# EAGLE schematic h_bridge_v2.1 (EAGLE 5.11)
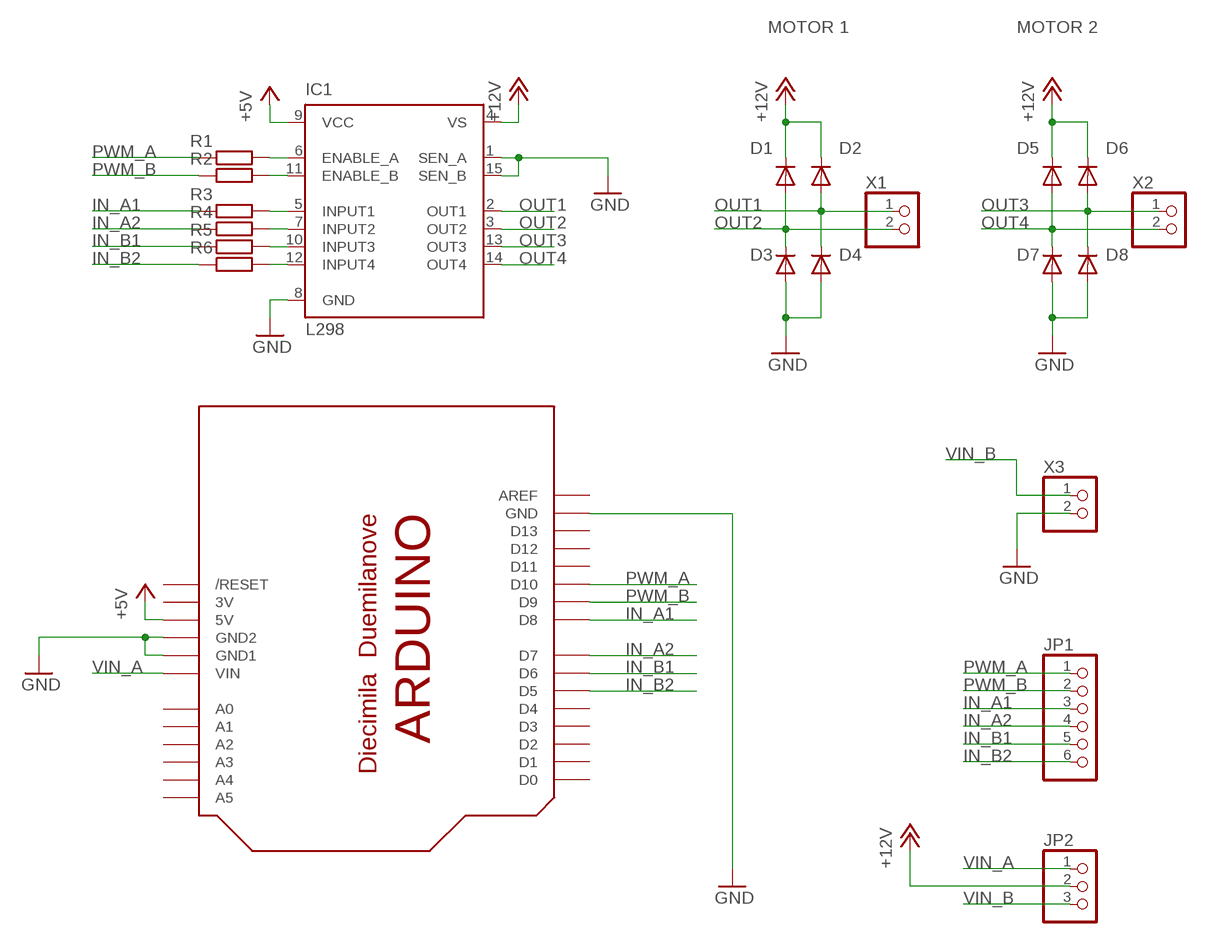
[diagram p0: schematic, sheet 1]

## Parts
D1  1N4004A  [DO41-10]
D2  1N4004A  [DO41-10]
D3  1N4004A  [DO41-10]
D4  1N4004A  [DO41-10]
D5  1N4004A  [DO41-10]
D6  1N4004A  [DO41-10]
D7  1N4004A  [DO41-10]
D8  1N4004A  [DO41-10]
IC1  L298  [MULTIWATT-15]
JP1  PINHD-1X6  [1X06]
JP2  PINHD-1X3180  [1X03]
R1  R-EU_0207/10  [0207/10]
R2  R-EU_0207/10  [0207/10]
R3  R-EU_0207/10  [0207/10]
R4  R-EU_0207/10  [0207/10]
R5  R-EU_0207/10  [0207/10]
R6  R-EU_0207/10  [0207/10]
U$1  ARDUINO-NOHOLE  [ARDUINO-NOHOLE]
X1  W237-102  [W237-102]
X2  W237-102  [W237-102]
X3  W237-102  [W237-102]

## Nets
+5V: IC1.9(VCC) U$1.5V
+12V: D1.C D2.C D5.C D6.C IC1.4(VS) JP2.2
GND: D3.A D4.A D7.A D8.A IC1.1(SEN_A) IC1.8(GND) IC1.15(SEN_B) U$1.GND U$1.GND1 U$1.GND2 X3.2
IN_A1: JP1.3 R3.1 U$1.D8
IN_A2: JP1.4 R4.1 U$1.D7
IN_B1: JP1.5 R5.1 U$1.D6
IN_B2: JP1.6 R6.1 U$1.D5
N$1: IC1.6(ENABLE_A) R1.2
N$2: IC1.11(ENABLE_B) R2.2
N$3: IC1.5(INPUT1) R3.2
N$4: IC1.7(INPUT2) R4.2
N$5: IC1.10(INPUT3) R5.2
N$6: IC1.12(INPUT4) R6.2
OUT1: D2.A D4.C IC1.2(OUT1) X1.1
OUT2: D1.A D3.C IC1.3(OUT2) X1.2
OUT3: D6.A D8.C IC1.13(OUT3) X2.1
OUT4: D5.A D7.C IC1.14(OUT4) X2.2
PWM_A: JP1.1 R1.1 U$1.D10
PWM_B: JP1.2 R2.1 U$1.D9
VIN_A: JP2.1 U$1.VIN
VIN_B: JP2.3 X3.1
Unconnected: U$1.A0 U$1.A1 U$1.A2 U$1.A3 U$1.A4 U$1.A5 U$1.AREF U$1.D0 U$1.D1 U$1.D2 U$1.D3 U$1.D4 U$1.D11 U$1.D12 U$1.D13 U$1.RESET(/RESET)

## Notes on the sheet
- MOTOR 1 | MOTOR 2

## Power pins joined to a net without a drawn wire
3V: U$1.3V

## Library data of the parts
D1-D8 = h_bridge_v2:1N4004: DIODE general purpose rectifier, 1 A
IC1 = h_bridge_v2:L298: DUAL FULL-BRIDGE DRIVER; MPN: L298N; OC_FARNELL: 1589425; OC_NEWARK: 32M1527
JP1 = h_bridge_v2:PINHD-1X6: PIN HEADER
JP2 = h_bridge_v2:PINHD-1X3: PIN HEADER
R1-R6 = h_bridge_v2:R-EU_: RESISTOR, European symbol
U$1 = h_bridge_v2:ARDUINO: Arduino Diecimila/Duemilanove Make a shield with ease, this package has all the named pins as well as the two mounting drill holes and an outline of the USB and DC power connector. The outline is on the DIMENSION layer, so if your board house uses it they will cut the outline to match. http://www.ladyada.net/library/pcb/eaglelibrary.html
X1-X3 = h_bridge_v2:W237-102: WAGO SCREW CLAMP